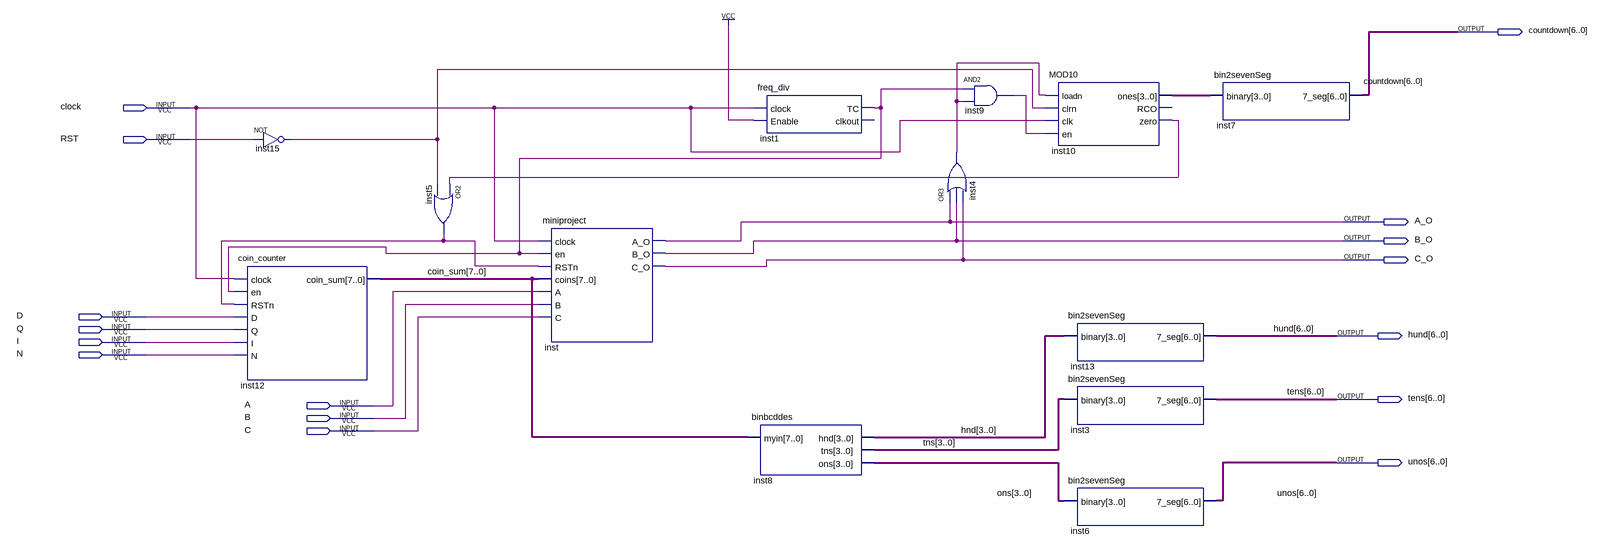
[diagram p0: schematic sheet]
// Quartus schematic TOP.bdf as structural Verilog: 13 symbols, 16 pins
module TOP (
  input  clock,
  input  RST,
  input  D,
  input  Q,
  input  I,
  input  N,
  input  A,
  input  B,
  input  C,
  output [6:0] countdown,
  output A_O,
  output B_O,
  output C_O,
  output [6:0] hund,
  output [6:0] tens,
  output [6:0] unos
);

  wire inst1_tc, inst4_out, inst5_out, inst9_out, inst10_zero, inst15_out;
  wire [3:0] hnd, inst10_ones, ons, tns;
  wire [7:0] coin_sum;

  coin_counter inst12 (.clock(clock), .en(inst1_tc), .RSTn(inst5_out), .D(D), .Q(Q), .I(I), .N(N), .coin_sum(coin_sum));
  not inst15 (inst15_out, RST);
  or inst5 (inst5_out, inst10_zero, inst15_out);
  miniproject inst (
    .clock(clock), .en(inst1_tc), .RSTn(inst5_out), .coins(coin_sum), .A(A), .B(B), .C(C), .A_O(A_O),
    .B_O(B_O), .C_O(C_O));
  freq_div inst1 (.clock(clock), .Enable(1'b1), .TC(inst1_tc));  // open: clkout
  binbcddes inst8 (.myin(coin_sum), .hnd(hnd), .tns(tns), .ons(ons));
  or inst4 (inst4_out, A_O, B_O, C_O);
  and inst9 (inst9_out, inst1_tc, inst4_out);
  MOD10 inst10 (
    .loadn(inst4_out), .clrn(inst15_out), .clk(clock), .en(inst9_out), .ones(inst10_ones), .zero(inst10_zero));  // open: RCO
  bin2sevenSeg inst13 (.binary(hnd), .\7_seg (hund));
  bin2sevenSeg inst3 (.binary(tns), .\7_seg (tens));
  bin2sevenSeg inst6 (.binary(ons), .\7_seg (unos));
  bin2sevenSeg inst7 (.binary(inst10_ones), .\7_seg (countdown));
endmodule
